# EAGLE design prototype1 (EAGLE 9.3.0)

## Sheet 1 of 5
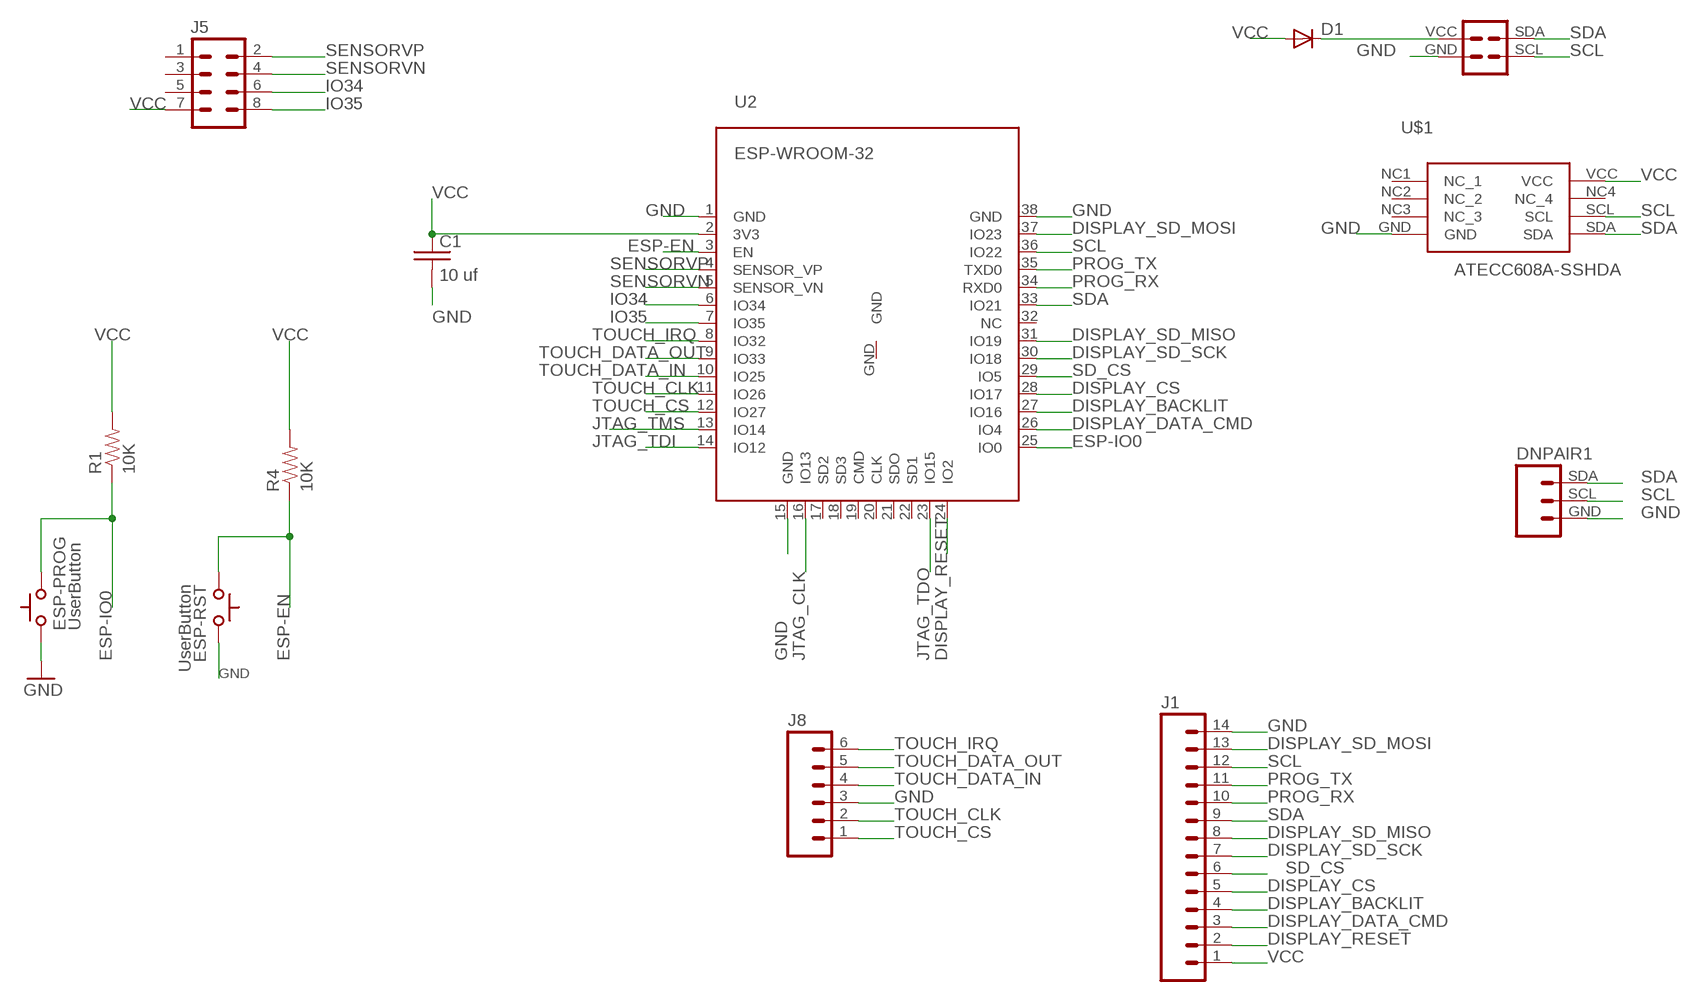
[diagram p0: schematic, sheet 1]

### Parts
C1  10 uf  C-USC0805  [C0805]
D1  DIODESMA  [SMA-DIODE]
DNPAIR1  DARKNET_8_PAIR_CONNECTORPTH  [1X03]
ESP-PROG  UserButton  SWITCH_TACTILETACTILE-2PIN-NARROW  [TACTILE-2PIN-NARROW]
ESP-RST  UserButton  SWITCH_TACTILETACTILE-2PIN-NARROW  [TACTILE-2PIN-NARROW]
J1  M14  [1X14]
J5  M04X2  [2X4]
J8  M06NO_SILK_YES_STOP  [1X06_NO_SILK_YES_STOP]
R1  10K  RESISTOR0805-RES  [0805]
R4  10K  RESISTOR0805-RES  [0805]
SHITTY_ADDON  SAO1  DC26_SHITTY_ADDON_CONNECTORPTH  [DC26SHITTY_ADDON_CONNECTOR]
U2  ESP-WROOM-32  [ESP-WROOM-32]
U$1  ATECC608A-SSHDA  [8-SOIC]

### Nets
DISPLAY_BACKLIT: J1.4 U2.27(IO16)
DISPLAY_CS: J1.5 U2.28(IO17)
DISPLAY_DATA_CMD: J1.3 U2.26(IO4)
DISPLAY_RESET: J1.2 U2.24(IO2)
DISPLAY_SD_MISO: J1.8 U2.31(IO19)
DISPLAY_SD_MOSI: J1.13 U2.37(IO23)
DISPLAY_SD_SCK: J1.7 U2.30(IO18)
ESP-EN: ESP-RST.P$2(C) R4.1 U2.3(EN)
ESP-IO0: ESP-PROG.P$1(A) R1.1 U2.25(IO0)
GND: C1.2 DNPAIR1.GND ESP-PROG.P$2(C) ESP-RST.P$1(A) J1.14 J8.3 SHITTY_ADDON.GND U2.1(GND) U2.15(GND) U2.38(GND) U$1.GND ; also sheet 2,3,4
IO34: J5.6 U2.6(IO34)
IO35: J5.8 U2.7(IO35)
JTAG_CLK: U2.16(IO13) ; also sheet 2
JTAG_TDI: U2.14(IO12) ; also sheet 2
JTAG_TDO: U2.23(IO15) ; also sheet 2
JTAG_TMS: U2.13(IO14) ; also sheet 2
N$14: D1.C SHITTY_ADDON.VCC
PROG_RX: J1.10 U2.34(RXD0)
PROG_TX: J1.11 U2.35(TXD0)
SCL: DNPAIR1.SCL J1.12 SHITTY_ADDON.SCL U2.36(IO22) U$1.SCL
SD_CS: J1.6 U2.29(IO5)
SDA: DNPAIR1.SDA J1.9 SHITTY_ADDON.SDA U2.33(IO21) U$1.SDA
SENSORVN: J5.4 U2.5(SENSOR_VN)
SENSORVP: J5.2 U2.4(SENSOR_VP)
TOUCH_CLK: J8.2 U2.11(IO26)
TOUCH_CS: J8.1 U2.12(IO27)
TOUCH_DATA_IN: J8.4 U2.10(IO25)
TOUCH_DATA_OUT: J8.5 U2.9(IO33)
TOUCH_IRQ: J8.6 U2.8(IO32)
VCC: C1.1 D1.A J1.1 J5.7 R1.2 R4.2 U2.2(3V3) U$1.VCC ; also sheet 2,3,4
Unconnected: J5.1 J5.3 J5.5 U2.17(SD2) U2.18(SD3) U2.19(CMD) U2.20(CLK) U2.21(SDO) U2.22(SD1) U2.32(NC) U2.GND U$1.NC1(NC_1) U$1.NC2(NC_2) U$1.NC3(NC_3) U$1.NC4(NC_4)

## Sheet 2 of 5
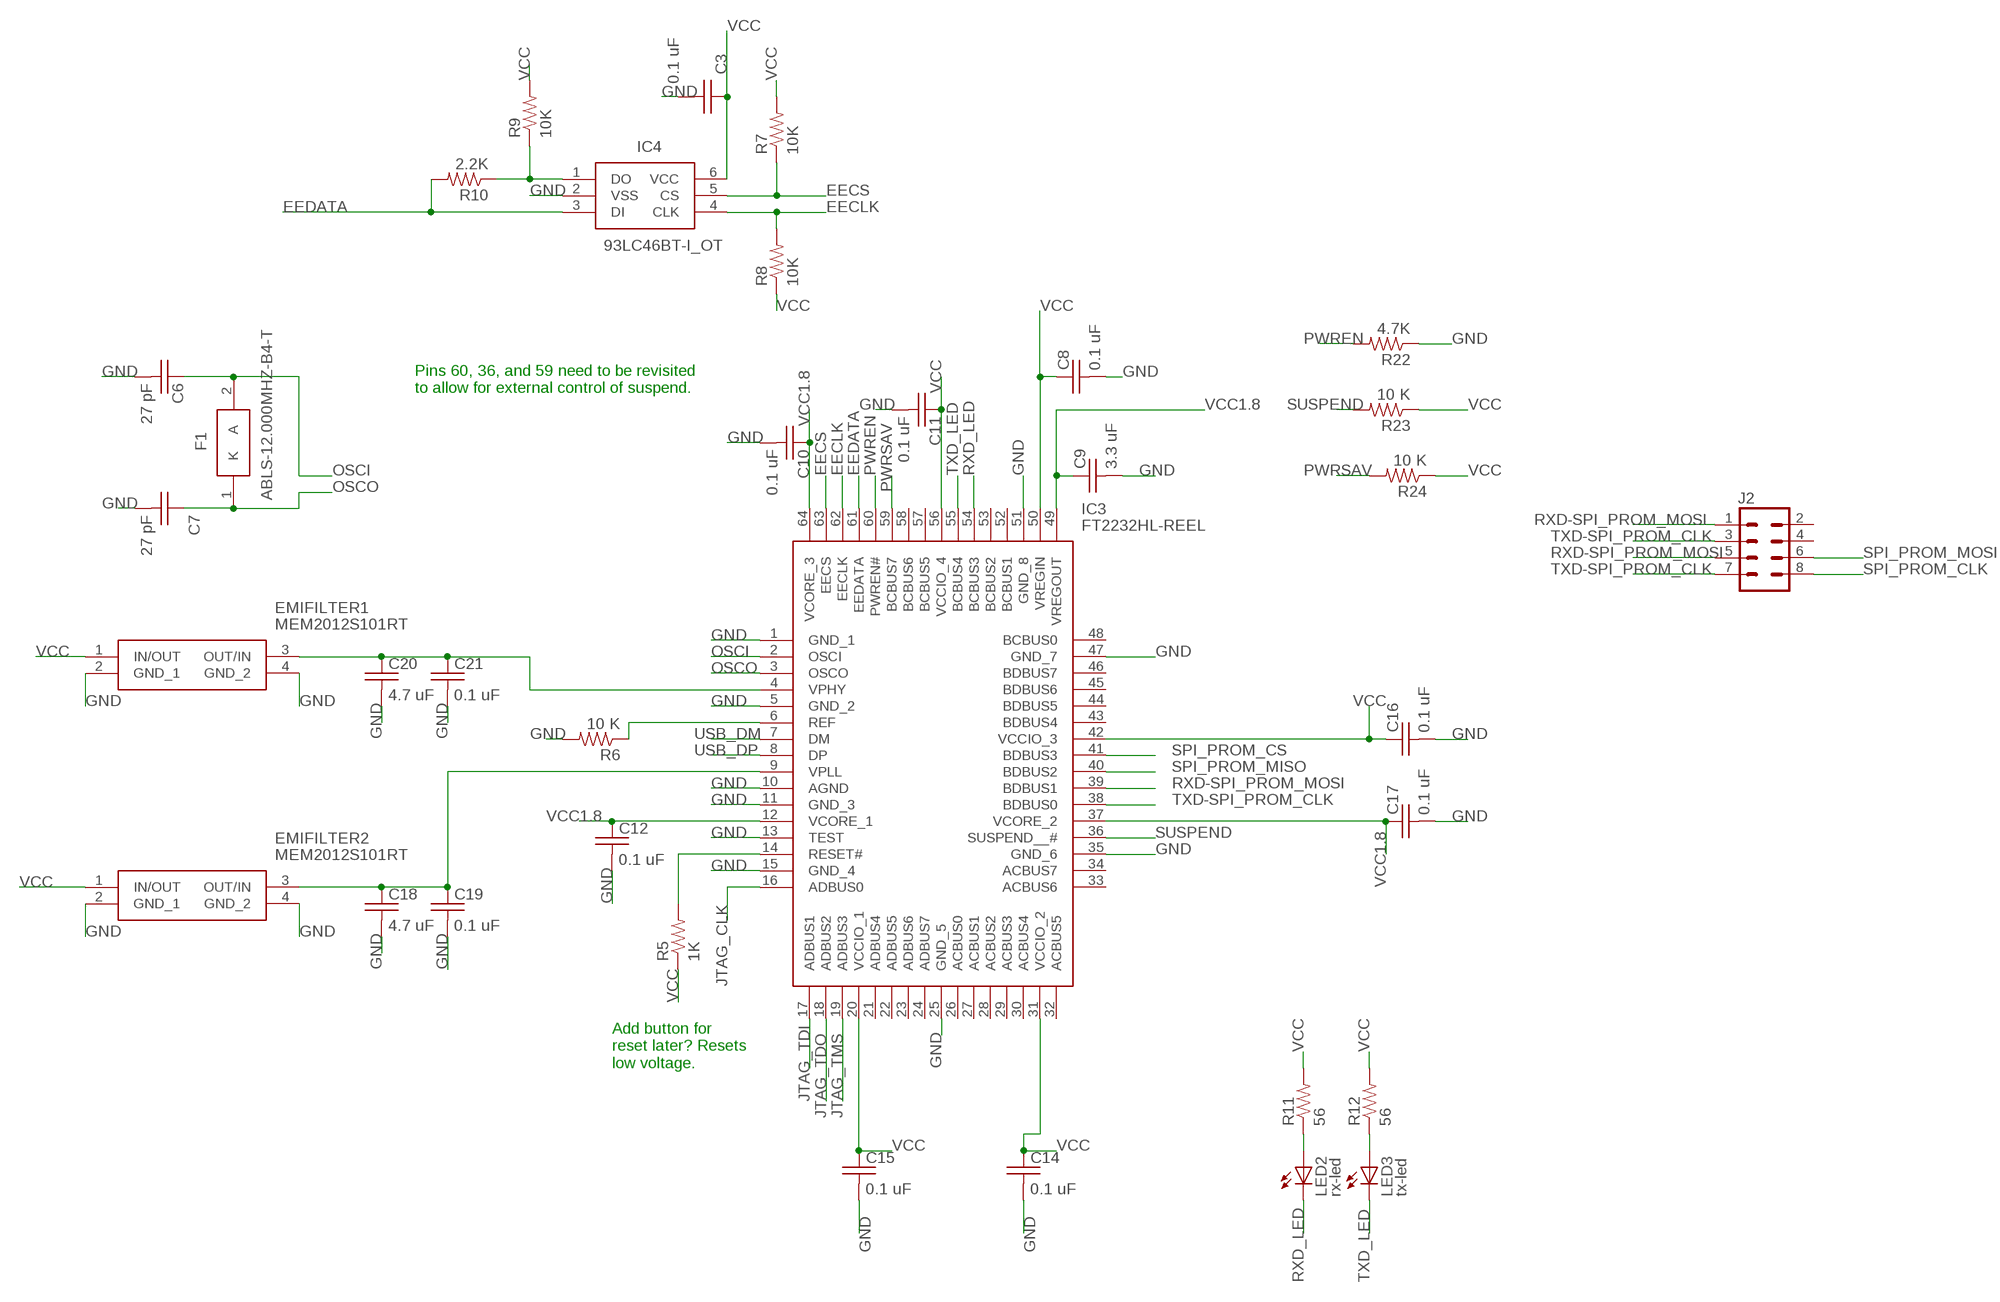
[diagram p1: schematic, sheet 2]

### Parts
C3  0.1 uF  C-USC0805  [C0805]
C6  27 pF  C-USC0805  [C0805]
C7  27 pF  C-USC0805  [C0805]
C8  0.1 uF  C-USC0805  [C0805]
C9  3.3 uF  C-USC0805  [C0805]
C10  0.1 uF  C-USC0805  [C0805]
C11  0.1 uF  C-USC0805  [C0805]
C12  0.1 uF  C-USC0805  [C0805]
C14  0.1 uF  C-USC0805  [C0805]
C15  0.1 uF  C-USC0805  [C0805]
C16  0.1 uF  C-USC0805  [C0805]
C17  0.1 uF  C-USC0805  [C0805]
C18  4.7 uF  C-USC0805  [C0805]
C19  0.1 uF  C-USC0805  [C0805]
C20  4.7 uF  C-USC0805  [C0805]
C21  0.1 uF  C-USC0805  [C0805]
EMIFILTER1  MEM2012S101RT  [MEM2012S101RT]
EMIFILTER2  MEM2012S101RT  [MEM2012S101RT]
F1  ABLS-12.000MHZ-B4-T  [HC/49US-(AT49)_1]
IC3  FT2232HL-REEL  [QFP50P1200X1200X160-64N]
IC4  93LC46BT-I_OT  [SOT95P270X145-6N]
J2  M04X2  [2X4]
LED2  rx-led  LED3MM  [LED3MM]
LED3  tx-led  LED3MM  [LED3MM]
R5  1K  RESISTOR0805-RES  [0805]
R6  10 K  RESISTOR0805-RES  [0805]
R7  10K  RESISTOR0805-RES  [0805]
R8  10K  RESISTOR0805-RES  [0805]
R9  10K  RESISTOR0805-RES  [0805]
R10  2.2K  RESISTOR0805-RES  [0805]
R11  56  RESISTOR0805-RES  [0805]
R12  56  RESISTOR0805-RES  [0805]
R22  4.7K  RESISTOR0805-RES  [0805]
R23  10 K  RESISTOR0805-RES  [0805]
R24  10 K  RESISTOR0805-RES  [0805]

### Nets
EECLK: IC3.62(EECLK) IC4.4(CLK) R8.2
EECS: IC3.63(EECS) IC4.5(CS) R7.1
EEDATA: IC3.61(EEDATA) IC4.3(DI) R10.2
GND: C3.2 C6.2 C7.2 C8.2 C9.2 C10.2 C11.2 C12.2 C14.2 C15.2 C16.2 C17.2 C18.2 C19.2 C20.2 C21.2 EMIFILTER1.2(GND_1) EMIFILTER1.4(GND_2) EMIFILTER2.2(GND_1) EMIFILTER2.4(GND_2) IC3.1(GND_1) IC3.5(GND_2) IC3.10(AGND) IC3.11(GND_3) IC3.13(TEST) IC3.15(GND_4) IC3.25(GND_5) IC3.35(GND_6) IC3.47(GND_7) IC3.51(GND_8) IC4.2(VSS) R6.2 R22.1 ; also sheet 1,3,4
JTAG_CLK: IC3.16(ADBUS0) ; also sheet 1
JTAG_TDI: IC3.17(ADBUS1) ; also sheet 1
JTAG_TDO: IC3.18(ADBUS2) ; also sheet 1
JTAG_TMS: IC3.19(ADBUS3) ; also sheet 1
N$6: IC3.14(RESET#) R5.2
N$7: IC3.6(REF) R6.1
N$8: IC4.1(DO) R9.1 R10.1
N$11: LED2.A R11.1
N$13: LED3.A R12.1
N$18: C18.1 C19.1 EMIFILTER2.3(OUT/IN) IC3.9(VPLL)
N$19: C20.1 C21.1 EMIFILTER1.3(OUT/IN) IC3.4(VPHY)
OSCI: C6.1 F1.2(A) IC3.2(OSCI)
OSCO: C7.1 F1.1(K) IC3.3(OSCO)
PWREN: IC3.60(PWREN#) R22.2
PWRSAV: IC3.59(BCBUS7) R24.2
RXD-SPI_PROM_MOSI: IC3.39(BDBUS1) J2.1 J2.5
RXD_LED: IC3.54(BCBUS3) LED2.K(C)
SPI_PROM_CLK: J2.8 ; also sheet 3
SPI_PROM_CS: IC3.41(BDBUS3) ; also sheet 3
SPI_PROM_MISO: IC3.40(BDBUS2) ; also sheet 3
SPI_PROM_MOSI: J2.6 ; also sheet 3
SUSPEND: IC3.36(SUSPEND__#) R23.2
TXD-SPI_PROM_CLK: IC3.38(BDBUS0) J2.3 J2.7
TXD_LED: IC3.55(BCBUS4) LED3.K(C)
USB_DM: IC3.7(DM) ; also sheet 4
USB_DP: IC3.8(DP) ; also sheet 4
VCC: C3.1 C8.1 C11.1 C14.1 C15.1 C16.1 EMIFILTER1.1(IN/OUT) EMIFILTER2.1(IN/OUT) IC3.20(VCCIO_1) IC3.31(VCCIO_2) IC3.42(VCCIO_3) IC3.50(VREGIN) IC3.56(VCCIO_4) IC4.6(VCC) R5.1 R7.2 R8.1 R9.2 R11.2 R12.2 R23.1 R24.1 ; also sheet 1,3,4
VCC1.8: C9.1 C10.1 C12.1 C17.1 IC3.12(VCORE_1) IC3.37(VCORE_2) IC3.49(VREGOUT) IC3.64(VCORE_3)
Unconnected: IC3.21(ADBUS4) IC3.22(ADBUS5) IC3.23(ADBUS6) IC3.24(ADBUS7) IC3.26(ACBUS0) IC3.27(ACBUS1) IC3.28(ACBUS2) IC3.29(ACBUS3) IC3.30(ACBUS4) IC3.32(ACBUS5) IC3.33(ACBUS6) IC3.34(ACBUS7) IC3.43(BDBUS4) IC3.44(BDBUS5) IC3.45(BDBUS6) IC3.46(BDBUS7) IC3.48(BCBUS0) IC3.52(BCBUS1) IC3.53(BCBUS2) IC3.57(BCBUS5) IC3.58(BCBUS6) J2.2 J2.4

### Notes on the sheet
- Pins 60, 36, and 59 need to be revisited 
  to allow for external control of suspend.
- Add button for 
  reset later? Resets
  low voltage.

## Sheet 3 of 5
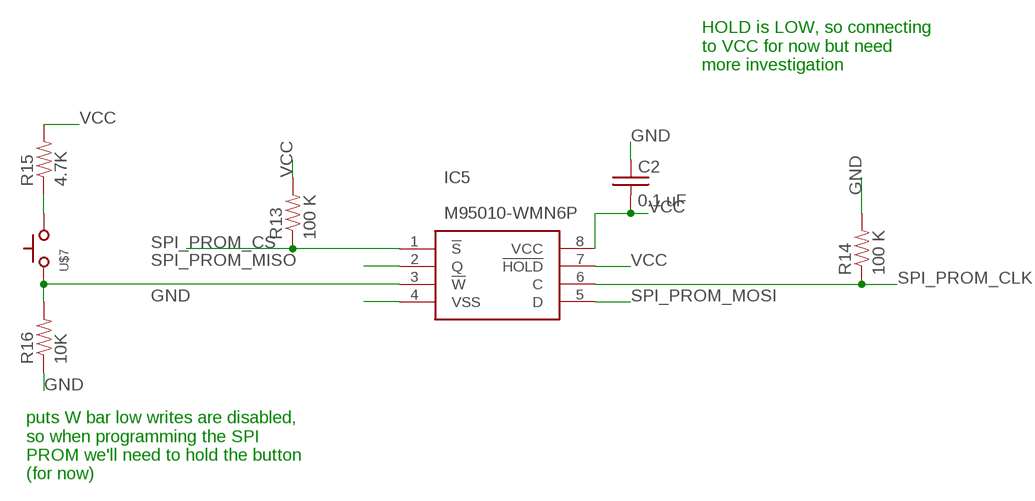
[diagram p2: schematic, sheet 3]

### Parts
C2  0.1 uF  C-USC0805  [C0805]
IC5  M95010-WMN6P  [SOIC127P600X175-8N]
R13  100 K  RESISTOR0805-RES  [0805]
R14  100 K  RESISTOR0805-RES  [0805]
R15  4.7K  RESISTOR0805-RES  [0805]
R16  10K  RESISTOR0805-RES  [0805]
U$7  SWITCH_TACTILETACTILE-2PIN-NARROW  [TACTILE-2PIN-NARROW]

### Nets
GND: C2.1 IC5.4(VSS) R14.2 R16.1 ; also sheet 1,2,4
N$3: IC5.3(!W) R16.2 U$7.P$2(C)
N$9: R15.1 U$7.P$1(A)
SPI_PROM_CLK: IC5.6(C) R14.1 ; also sheet 2
SPI_PROM_CS: IC5.1(!S) R13.1 ; also sheet 2
SPI_PROM_MISO: IC5.2(Q) ; also sheet 2
SPI_PROM_MOSI: IC5.5(D) ; also sheet 2
VCC: C2.2 IC5.7(!HOLD) IC5.8(VCC) R13.2 R15.2 ; also sheet 1,2,4

### Notes on the sheet
- HOLD is LOW, so connecting 
  to VCC for now but need 
  more investigation
- puts W bar low writes are disabled, 
  so when programming the SPI 
  PROM we'll need to hold the button 
  (for now)

## Sheet 4 of 5
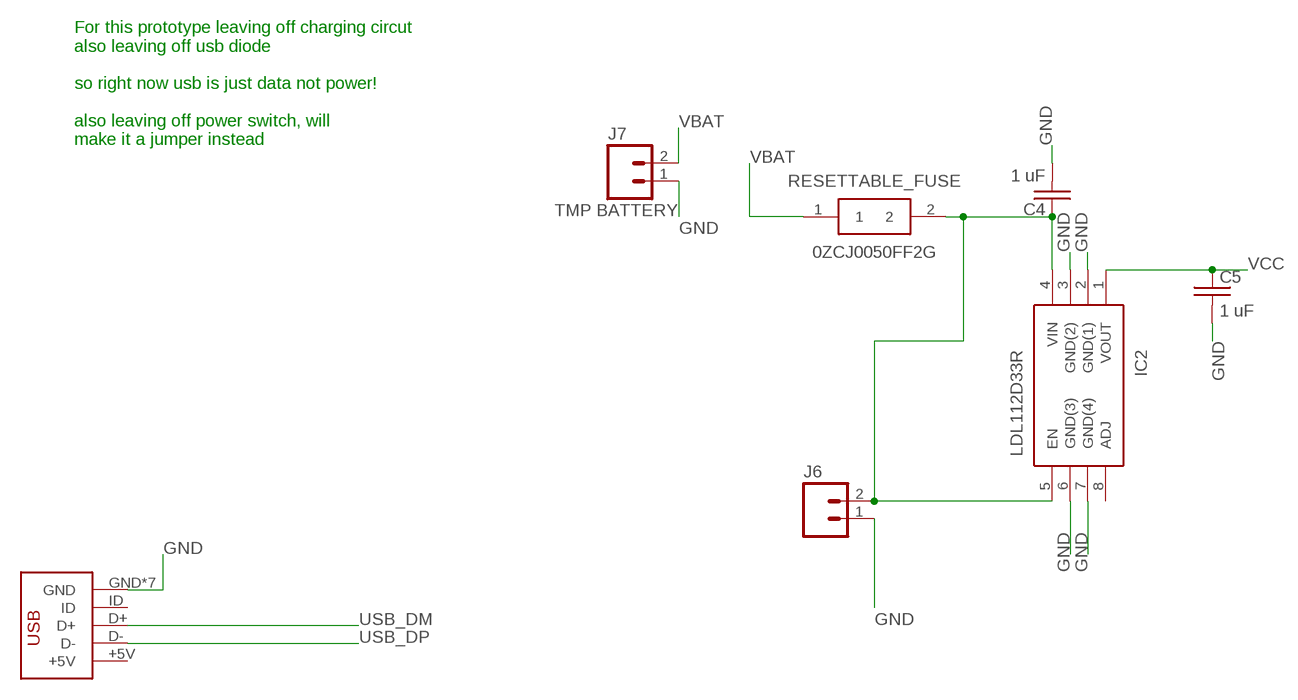
[diagram p3: schematic, sheet 4]

### Parts
C4  1 uF  C-USC0805  [C0805]
C5  1 uF  C-USC0805  [C0805]
IC2  LDL112D33R  [SOIC127P600X175-8N]
J6  M02PTH  [1X02]
J7  TMP BATTERY  M02PTH  [1X02]
RESETTABLE_FUSE  0ZCJ0050FF2G  [FUSC3216X55N]
U$2  DX4R005JJ2DX4R005JJ2  [DX4R005JJ2]

### Nets
GND: C4.2 C5.2 IC2.2(GND(1)) IC2.3(GND(2)) IC2.6(GND(3)) IC2.7(GND(4)) J6.1 J7.1 U$2.GND U$2.P$6(GND) U$2.P$7(GND) U$2.P$8(GND) U$2.P$9(GND) U$2.P$10(GND) U$2.P$11(GND) ; also sheet 1,2,3
N$12: C4.1 IC2.4(VIN) IC2.5(EN) J6.2 RESETTABLE_FUSE.2
USB_DM: U$2.D+ ; also sheet 2
USB_DP: U$2.D- ; also sheet 2
VBAT: J7.2 RESETTABLE_FUSE.1
VCC: C5.1 IC2.1(VOUT) ; also sheet 1,2,3
Unconnected: IC2.8(ADJ) U$2.+5V U$2.ID

### Notes on the sheet
- For this prototype leaving off charging circut
  also leaving off usb diode
  
  so right now usb is just data not power!
  
  also leaving off power switch, will 
  make it a jumper instead

## Sheet 5 of 5
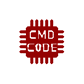
[diagram p4: schematic, sheet 5]

### Parts
U$3  CMD_C0DE_LOGOCMD_CODE_LOGO_TOP_COPPER  [CMD_C0DE_LOGO_TOP_COPPER]

## Library data of the parts
C1-C12 C14-C21 = passives:C-US: CAPACITOR, American symbol
D1 = passives:DIODE: Diode These are standard reverse protection diodes and small signal diodes. SMA package can handle up to about 1A. SOD-323 can handle about 200mA. What the SOD-323 package when ordering, there are some mfgs out there that are 5-pin packages.
DNPAIR1 = darknet8:DARKNET_8_PAIR_CONNECTOR: Header 3 Standard 3-pin 0.1" header. Use with straight break away headers (SKU : PRT-00116), right angle break away headers (PRT-00553), swiss pins (PRT-00743), machine pins (PRT-00117), and female headers (PRT-00115).
EMIFILTER1 EMIFILTER2 = passives:MEM2012S101RT: EMI Filter Circuits Source: Datasheet <https://componentsearchengine.com/Datasheets/1/MEM2012S101RT.pdf>; DESCRIPTION: EMI Filter Circuits; HEIGHT: 1mm; MANUFACTURER_NAME: TDK; MANUFACTURER_PART_NUMBER: MEM2012S101RT; MOUSER_PART_NUMBER: N/A
ESP-PROG ESP-RST = dc-26:SWITCH_TACTILE
F1 = crystals-timing:ABLS-12.000MHZ-B4-T: ABRACON - ABLS-12.000MHZ-B4-T - CRYSTAL, 12MHZ, 18PF, HC-49US Source: Datasheet <https://componentsearchengine.com/Datasheets/2/ABLS-12.000MHZ-B4-T.pdf>; DESCRIPTION: ABRACON - ABLS-12.000MHZ-B4-T - CRYSTAL, 12MHZ, 18PF, HC-49US; HEIGHT: mm; MANUFACTURER_NAME: ABRACON; MANUFACTURER_PART_NUMBER: ABLS-12.000MHZ-B4-T; MOUSER_PART_NUMBER: 815-ABLS-12.0M-T; MOUSER_PRICE-STOCK: https://www.mouser.com/Search/Refine.aspx?Keyword=815-ABLS-12.0M-T; RS_PART_NUMBER: 1710207; RS_PRICE-STOCK: http://uk.rs-online.com/web/p/products/1710207
IC2 = voltage-regulator:LDL112D33R: LDO Voltage Regulators 1.2 A low quiescent current LDO with reverse current protection Source: Datasheet <https://www.arrow.com/en/products/ldl112d33r/stmicroelectronics>; ARROW_PART_NUMBER: LDL112D33R; ARROW_PRICE/STOCK: https://www.arrow.com/en/products/ldl112d33r/stmicroelectronics; DESCRIPTION: LDO Voltage Regulators 1.2 A low quiescent current LDO with reverse current protection; HEIGHT: 1.75mm; MANUFACTURER_NAME: STMicroelectronics; MANUFACTURER_PART_NUMBER: LDL112D33R
IC3 = ICs:FT2232HL-REEL: FTDI Chip FT2232HL-REEL, USB Controller, 4-channel, 480MBps, USB 2.0, 64-Pin LQFP Source: Datasheet <https://componentsearchengine.com/Datasheets/1/FT2232HL-REEL.pdf>; DESCRIPTION: FTDI Chip FT2232HL-REEL, USB Controller, 4-channel, 480MBps, USB 2.0, 64-Pin LQFP; HEIGHT: 1.6mm; MANUFACTURER_NAME: FTDI Chip; MANUFACTURER_PART_NUMBER: FT2232HL-REEL; MOUSER_PART_NUMBER: 895-FT2232HL
IC4 = eeprom:93LC46BT-I_OT: 1K,64 X 16 Serial EE,SOT23 Source: Datasheet <https://componentsearchengine.com/Datasheets/1/93LC46BT-I_OT.pdf>; DESCRIPTION: 1K,64 X 16 Serial EE,SOT23; HEIGHT: 1.45mm; MANUFACTURER_NAME: Microchip; MANUFACTURER_PART_NUMBER: 93LC46BT-I/OT; MOUSER_PART_NUMBER: 579-93LC46BT-I/OT
IC5 = eeprom:M95010-WMN6P: M95010-WMN6P, Serial EEPROM Memory 1kbit, Serial-SPI, 35ns 2.5 5.5 V, 8-Pin SOIC Source: Datasheet <http://www.st.com/st-web-ui/static/active/en/resource/technical/document/datasheet/CD00001755.pdf>; ALLIED_NUMBER: 70389563; ALLIED_PRICE-STOCK: http://www.alliedelec.com/stmicroelectronics-m95010-wmn6p/70389563/; DESCRIPTION: M95010-WMN6P, Serial EEPROM Memory 1kbit, Serial-SPI, 35ns 2.5 5.5 V, 8-Pin SOIC; HEIGHT: 1.75mm; MANUFACTURER_NAME: STMicroelectronics; MANUFACTURER_PART_NUMBER: M95010-WMN6P; MOUSER_PART_NUMBER: 511-M95010-WMN6P; MOUSER_PRICE-STOCK: https://www.mouser.com/Search/Refine.aspx?Keyword=511-M95010-WMN6P; RS_PART_NUMBER: 7147617; RS_PRICE-STOCK: http://uk.rs-online.com/web/p/eeprom-memory-chips/7147617/?source=DS
J1 = connector:M14: Header 14 Standard 14-pin 0.1" header. Use with straight break away headers (SKU : PRT-00116), right angle break away headers (PRT-00553), swiss pins (PRT-00743), machine pins (PRT-00117), and female headers (PRT-00115).
J2 J5 = connector:M04X2: .1" header, two rows of four.
J6 J7 = connector:M02: Standard 2-pin 0.1" header. Use with - straight break away headers ( PRT-00116) - right angle break away headers (PRT-00553) - swiss pins (PRT-00743) - machine pins (PRT-00117) - female headers (PRT-00115) Molex polarized connector foot print use with: PRT-08233 with associated crimp pins and housings. 2.54_SCREWTERM for use with PRT-10571. 3.5mm Screw Terminal footprints for PRT-08084 5mm Screw Terminal footprints for use with PRT-08432
J8 = connector:M06: Header 6 Standard 6-pin 0.1" header. Use with straight break away headers (SKU : PRT-00116), right angle break away headers (PRT-00553), swiss pins (PRT-00743), machine pins (PRT-00117), and female headers (PRT-00115). Molex polarized connector foot print use with SKU : PRT-08094 with associated crimp pins and housings. NOTES ON THE VARIANTS LOCK and LOCK_LONGPADS... This footprint was designed to help hold the alignment of a through-hole component (i.e. 6-pin header) while soldering it into place. You may notice that each hole has been shifted either up or down by 0.005 of an inch from it's more standard position (which is a perfectly straight line). This slight alteration caused the pins (the squares in the middle) to touch the edges of the holes. Because they are alternating, it causes a "brace" to hold the component in place. 0.005 has proven to be the perfect amount of "off-center" position when using our standard breakaway headers. Although looks a little odd when you look at the bare footprint, once you have a header in there, the alteration is very hard to notice. Also,if you push a header all the way into place, it is covered up entirely on the bottom side. This idea of altering the position of holes to aid alignment will be further integrated into the Sparkfun Library for other footprints. It can help hold any component with 3 or more connection pins.
LED2 LED3 = leds:LED: LEDs Standard schematic elements and footprints for 5mm, 3mm, 1206, and 0603 sized LEDs. 5mm - Spark Fun Electronics SKU : COM-00529 (and others)
R1 R4 = dc-26:RESISTOR: Resistor Basic schematic elements and footprints for 0603, 1206, and PTH resistors.
R5-R16 R22-R24 = passives:RESISTOR: Resistor Basic schematic elements and footprints for 0603, 1206, and PTH resistors.
RESETTABLE_FUSE = passives:0ZCJ0050FF2G: Resettable Fuses - PPTC <https://componentsearchengine.com/Images/9/0ZCJ0050FF2G.jpg> Source: Datasheet <https://www.belfuse.com/resources/CircuitProtection/datasheets/0ZCJ Nov2016.pdf>; DESCRIPTION: Resettable Fuses - PPTC; HEIGHT: 0.55mm; MANUFACTURER_NAME: Bel-Stewart; MANUFACTURER_PART_NUMBER: 0ZCJ0050FF2G; SUPPLIER_NAME: RS
SHITTY_ADDON = defcon:DC26_SHITTY_ADDON_CONNECTOR: Standard 2-pin 0.1" header. Use with - straight break away headers ( PRT-00116) - right angle break away headers (PRT-00553) - swiss pins (PRT-00743) - machine pins (PRT-00117) - female headers (PRT-00115) Molex polarized connector foot print use with: PRT-08233 with associated crimp pins and housings. 2.54_SCREWTERM for use with PRT-10571. 3.5mm Screw Terminal footprints for PRT-08084 5mm Screw Terminal footprints for use with PRT-08432
U2 = ICs:ESP-WROOM-32
U$1 = ICs:ATECC608A-SSHDA
U$2 = connector:DX4R005JJ2
U$3 = logos:CMD_C0DE_LOGO
U$7 = switches:SWITCH_TACTILE

## Board
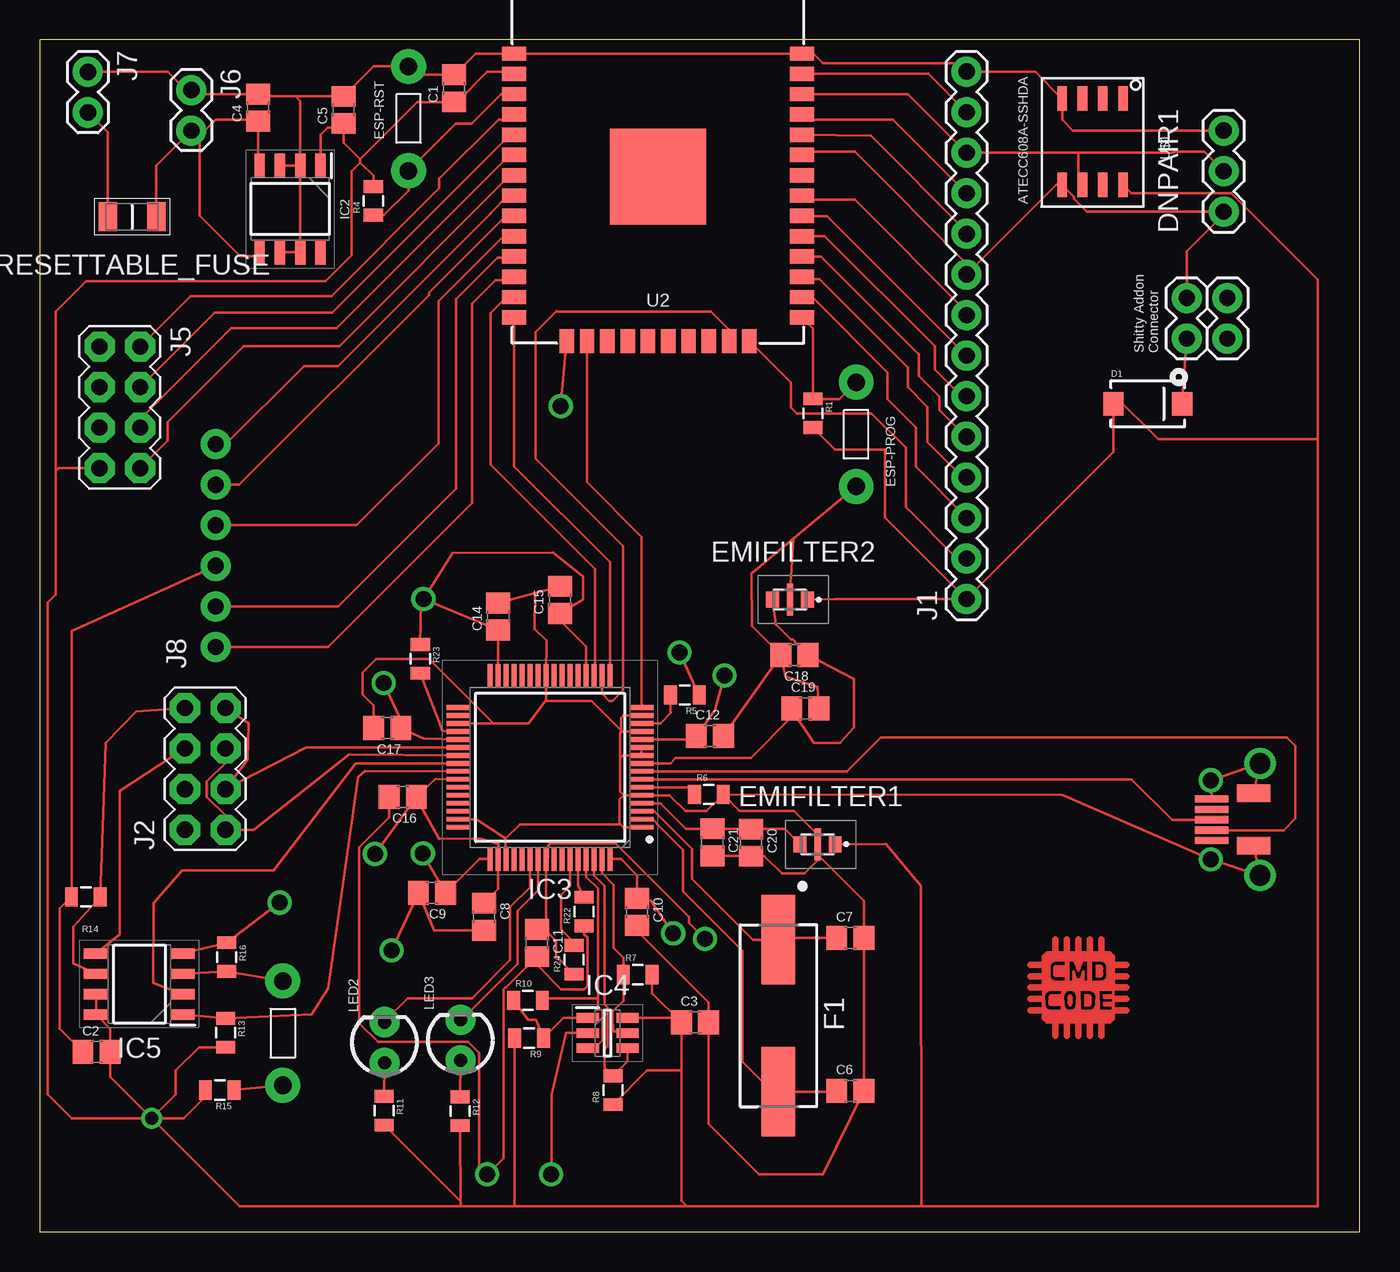
[diagram p5: board, top side]
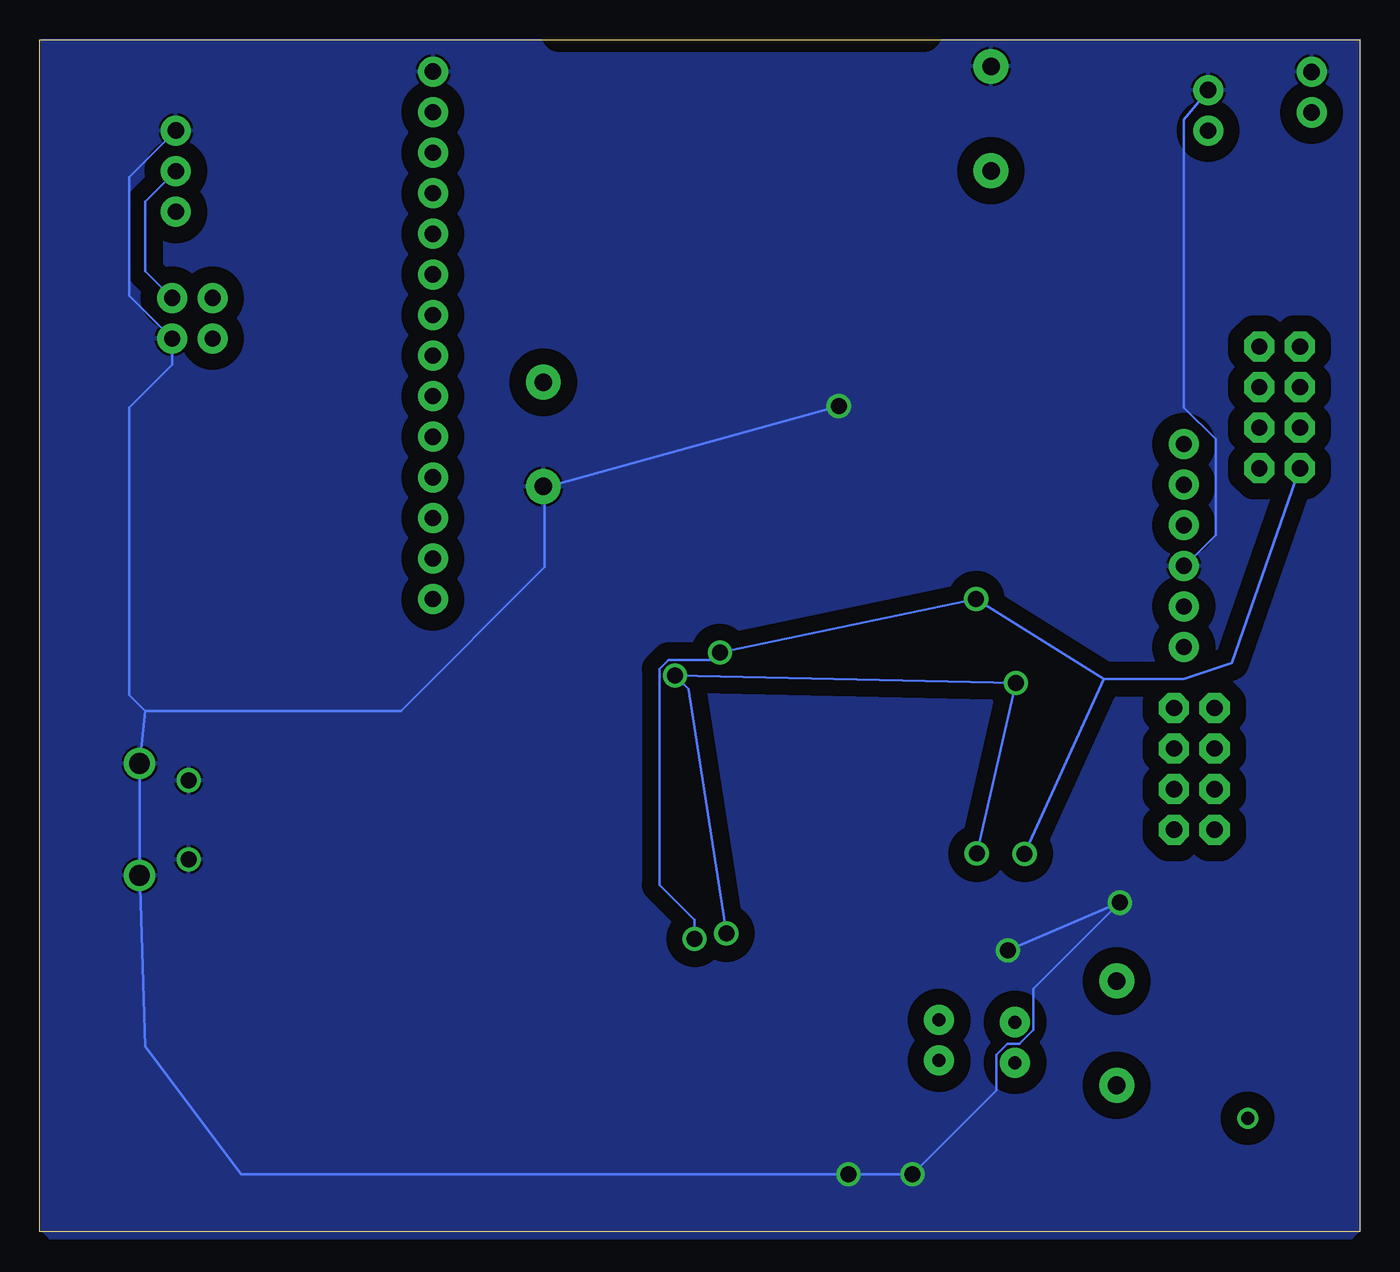
[diagram p6: board, bottom side, seen from below]

Size 82.6 x 74.6 mm. Coordinates in mm from the lower left corner, seen from the top.
Outline: 0,0 82.6,0 82.6,74.6 0,74.6 0,0
Copper layers (1*16): Top 0.035mm / dielectric 1.5mm / Bottom 0.035mm
Design rules "OthermillDRC_30_deg_v2 *": minimum track width 6mil, minimum drill 0.8mm, track to track 9mil, track to pad 6mil, pad to pad 6mil, via to via 6mil, smd to smd 0mil, copper to edge 0mil, drill to drill 6mil, minimum pad ring 10mil, minimum via ring 10mil, stop-mask expansion 1mil, vias tented up to drill 30mil, thermal gap 6mil

### Footprints (pad centres in the part's own frame; a part is rotated, then mirrored left to right if it is on the bottom)
C0805 = smd 1.3 x 1.5: 1 -0.85,0; 2 0.85,0
SMA-DIODE = smd 1.27 x 1.47: A -2.15,0; C 2.15,0
1X03 = drill 1.016 pad 1.88: GND 5.08,0; SCL 2.54,0; SDA 0,0
MEM2012S101RT = smd 0.8 x 1: 1 -1.1,0; 3 1.1,0 | smd 0.4 x 1: 2 0,-0.5; 4 0,0.5
TACTILE-2PIN-NARROW = drill 1.1 pad 2.184: P$1 3.264,0; P$2 -3.264,0
HC/49US-(AT49)_1 = smd 5.6 x 2.1: 1 -4.75,0; 2 4.75,0
SOIC127P600X175-8N = smd 1.525 x 0.65: 1 -2.712,1.905; 2 -2.712,0.635; 3 -2.712,-0.635; 4 -2.712,-1.905; 5 2.712,-1.905; 6 2.712,-0.635; 7 2.712,0.635; 8 2.712,1.905
QFP50P1200X1200X160-64N = smd 1.475 x 0.3: 1 -5.738,3.75; 2 -5.738,3.25; 3 -5.738,2.75; 4 -5.738,2.25; 5 -5.738,1.75; 6 -5.738,1.25; 7 -5.738,0.75; 8 -5.738,0.25; 9 -5.738,-0.25; 10 -5.738,-0.75; 11 -5.738,-1.25; 12 -5.738,-1.75; 13 -5.738,-2.25; 14 -5.738,-2.75; 15 -5.738,-3.25; 16 -5.738,-3.75; 33 5.738,-3.75; 34 5.738,-3.25; 35 5.738,-2.75; 36 5.738,-2.25; 37 5.738,-1.75; 38 5.738,-1.25; 39 5.738,-0.75; 40 5.738,-0.25; 41 5.738,0.25; 42 5.738,0.75; 43 5.738,1.25; 44 5.738,1.75; 45 5.738,2.25; 46 5.738,2.75; 47 5.738,3.25; 48 5.738,3.75 | smd 0.3 x 1.475: 17 -3.75,-5.738; 18 -3.25,-5.738; 19 -2.75,-5.738; 20 -2.25,-5.738; 21 -1.75,-5.738; 22 -1.25,-5.738; 23 -0.75,-5.738; 24 -0.25,-5.738; 25 0.25,-5.738; 26 0.75,-5.738; 27 1.25,-5.738; 28 1.75,-5.738; 29 2.25,-5.738; 30 2.75,-5.738; 31 3.25,-5.738; 32 3.75,-5.738; 49 3.75,5.738; 50 3.25,5.738; 51 2.75,5.738; 52 2.25,5.738; 53 1.75,5.738; 54 1.25,5.738; 55 0.75,5.738; 56 0.25,5.738; 57 -0.25,5.738; 58 -0.75,5.738; 59 -1.25,5.738; 60 -1.75,5.738; 61 -2.25,5.738; 62 -2.75,5.738; 63 -3.25,5.738; 64 -3.75,5.738
SOT95P270X145-6N = smd 1.4 x 0.6: 1 -1.25,0.95; 2 -1.25,0; 3 -1.25,-0.95; 4 1.25,-0.95; 5 1.25,0; 6 1.25,0.95
1X14 = drill 1.016 pad 1.88: 1 0,0; 2 2.54,0; 3 5.08,0; 4 7.62,0; 5 10.16,0; 6 12.7,0; 7 15.24,0; 8 17.78,0; 9 20.32,0; 10 22.86,0; 11 25.4,0; 12 27.94,0; 13 30.48,0; 14 33.02,0
2X4 = drill 1.016 pad 1.88 octagon: 1 -3.81,-1.27; 2 -3.81,1.27; 3 -1.27,-1.27; 4 -1.27,1.27; 5 1.27,-1.27; 6 1.27,1.27; 7 3.81,-1.27; 8 3.81,1.27
1X02 = drill 1.016 pad 1.88: 1 0,0; 2 2.54,0
1X06_NO_SILK_YES_STOP = drill 1.016 pad 1.88: 1 0,0; 2 2.54,0; 3 5.08,0; 4 7.62,0; 5 10.16,0; 6 12.7,0
LED3MM = drill 0.813 pad 1.88: A -1.27,0; K 1.27,0
0805 = smd 0.8 x 1.2: 1 -0.9,0; 2 0.9,0
FUSC3216X55N = smd 1.17 x 1.82: 1 -1.52,0; 2 1.52,0
DC26SHITTY_ADDON_CONNECTOR = drill 1.016 pad 1.88: GND 0,-2.54; SCL 2.54,-2.54; SDA 2.54,0; VCC 0,0
ESP-WROOM-32 = smd 0.9 x 1.5: 1 7.7,9; 2 6.43,9; 3 5.16,9; 4 3.89,9; 5 2.62,9; 6 1.35,9; 7 0.08,9; 8 -1.19,9; 9 -2.46,9; 10 -3.73,9; 11 -5,9; 12 -6.27,9; 13 -7.54,9; 14 -8.81,9; 25 -8.81,-9; 26 -7.54,-9; 27 -6.27,-9; 28 -5,-9; 29 -3.73,-9; 30 -2.46,-9; 31 -1.19,-9; 32 0.08,-9; 33 1.35,-9; 34 2.62,-9; 35 3.89,-9; 36 5.16,-9; 37 6.43,-9; 38 7.7,-9 | smd 1.5 x 0.9: 15 -10.3,5.715; 16 -10.3,4.445; 17 -10.3,3.175; 18 -10.3,1.905; 19 -10.3,0.635; 20 -10.3,-0.635; 21 -10.3,-1.905; 22 -10.3,-3.175; 23 -10.3,-4.445; 24 -10.3,-5.715 | smd 6 x 6: GND 0,0
8-SOIC = smd 0.6 x 1.55: GND 3.81,0; NC1 0,0; NC2 1.27,0; NC3 2.54,0; NC4 1.27,5.4; SCL 2.54,5.4; SDA 3.81,5.4; VCC 0,5.4
DX4R005JJ2 = smd 2.1 x 0.45: +5V 0.72,-1.32; D+ 0.72,-0.02; D- 0.72,-0.67; GND 0.72,1.28; ID 0.72,0.63 | smd 2.1 x 1.1: P$6 3.35,1.65; P$8 3.35,-1.65 | drill 1: P$7 0.675,2.45; P$9 0.675,-2.5 | drill 1.3: P$10 3.75,-3.5; P$11 3.75,3.5

### Placement (x,y rotation side)
C1  25.93,71.57 90 top
C2  3.55,11.25 0 top
C3  41,13.1 0 top
C4  13.66,70.36 90 top
C5  19.01,70.22 90 top
C6  50.73,8.82 0 top
C7  50.73,18.39 0 top
C8  27.79,19.72 270 top
C9  24.54,21.22 180 top
C10  37.37,20.02 270 top
C11  31.1,18.07 270 top
C12  41.93,31.04 0 top
C14  28.69,38.51 90 top
C15  32.54,39.55 90 top
C16  22.71,27.21 180 top
C17  21.74,31.53 180 top
C18  47.23,36.1 180 top
C19  47.9,32.76 0 top
C20  44.51,24.35 270 top
C21  42.08,24.37 270 top
D1  69.34,51.83 0 top
DNPAIR1  74.09,63.85 90 top
EMIFILTER1  48.67,24.25 180 top
EMIFILTER2  46.95,39.56 180 top
ESP-PROG  51.09,49.91 90 top
ESP-RST  23.07,69.68 90 top
F1  46.22,13.52 270 top
IC2  15.66,64.02 270 top
IC3  31.93,29.07 180 top
IC4  35.53,12.43 0 top
IC5  6.22,15.5 180 top
J1  58,39.6 90 top
J2  10.35,28.97 90 top
J5  5,51.6 270 top
J6  9.48,71.46 270 top
J7  3,72.6 270 top
J8  11,36.6 90 top
LED2  21.57,11.85 90 top
LED3  26.32,11.99 90 top
R1  48.39,51.23 270 top
R4  20.87,64.52 90 top
R5  40.37,33.61 180 top
R6  41.87,27.36 0 top
R7  37.42,16.09 0 top
R8  35.87,8.85 90 top
R9  30.62,12.12 180 top
R10  30.54,14.48 0 top
R11  21.54,7.58 270 top
R12  26.3,7.54 270 top
R13  11.62,12.45 270 top
R14  2.88,20.95 180 top
R15  11.26,8.87 180 top
R16  11.7,17.19 270 top
R22  34.05,20.04 90 top
R23  23.81,35.86 270 top
R24  33.43,17.02 90 top
RESETTABLE_FUSE  5.77,63.53 0 top
SHITTY_ADDON  71.79,55.91 90 top
U2  38.69,66.04 90 top
U$1  67.79,70.93 180 top
U$2  72.62,25.81 0 top
U$3  65,15.6 0 top
U$7  15.2,12.43 270 top

### Tracks (layer width: path | path; a pad name or v marks a point on that pad's centre or on a via)
DISPLAY_BACKLIT
  Top 0.152: U2.27 47.82,59.64 48.79,59.64 54.33,54.1 54.33,52.86 55.56,51.63 55.56,49.42 57.76,47.22 J1.4
DISPLAY_CS
  Top 0.152: U2.28 48.88,61.04 55.03,54.89 55.03,53.54 56.29,52.29 56.29,51.43 57.96,49.76 J1.5
DISPLAY_DATA_CMD
  Top 0.152: U2.26 48.34,58.5 53.06,53.79 53.06,52.12 54.83,50.35 54.83,47.89 58,44.72 J1.3
DISPLAY_RESET
  Top 0.152: U2.24 47,53.15 47,51.6 47.38,51.22 52.05,51.22 54.19,49.07 54.19,45.35 57.4,42.14 J1.2
DISPLAY_SD_MISO
  Top 0.152: U2.31 47.94,64.6 51,64.6 58,57.6 J1.8
DISPLAY_SD_MOSI
  Top 0.152: U2.37 55.61,72.47 J1.13
DISPLAY_SD_SCK
  Top 0.152: U2.30 49.26,63.58 J1.7
EECLK
  Top 0.152: IC3.62 34.68,22.29 35.33,21.64 35.33,14.24 35.51,14.05 35.51,11.59 35.33,11.41 35.33,10.29 R8.2 36.78,10.67 IC4.4
EECS
  Top 0.152: IC3.63 35.18,22.45 35.92,21.72 35.92,17.76 36.52,17.15 R7.1 36.52,14.45 35.85,13.78 35.85,12.99 35.88,12.96 35.88,12.55 36.67,12.55 IC4.5
EEDATA
  Top 0.152: IC3.61 34.18,22.22 34.93,21.48 34.93,14.61 | 34.93,14.61 34.93,14.06 35.21,13.78 35.21,11.97 34.73,11.48 IC4.3 | 34.93,14.61 31.57,14.61 R10.2
ESP-EN
  Top 0.152: U2.3 28.87,71.2 27.01,69.34 26,69.34 ESP-RST.P$2 23.07,65.17 21.52,63.62 R4.1
ESP-IO0
  Top 0.152: U2.25 48.39,56.53 R1.1 50.05,52.13 ESP-PROG.P$1
GND  (via drill 1)
  Top 0.152: 16,71.07 C5.2 20.89,72.94 ESP-RST.P$1 23.6,72.42 C1.2 27.26,73.74 U2.1 U2.38 48.42,73.74 49.01,73.15 57.47,73.15 J1.14 58.02,72.6 62.31,72.6 U$1.GND 64,70.91 64,69.6 64.67,68.93 DNPAIR1.GND | 16,71.07 13.8,71.07 C4.2 9.73,71.21 J6.1 9.14,71.46 8,72.6 J7.1 | R6.2 41.74,26.33 40.41,26.33 39.42,27.32 IC3.5 36.56,27.32 | R6.2 43.8,26.34 47.21,26.34 48.67,24.87 EMIFILTER1.2 EMIFILTER1.4 48.67,23.62 | C21.2 44.49,23.52 C20.2 45.34,23.5 46.43,22.42 47.85,22.42 48.67,23.24 48.67,23.62 | 48.67,23.62 51.58,20.72 C7.2 C6.2 49,3.6 45,3.6 41.85,6.75 C3.2 41.85,14.37 37.38,18.84 C10.2 | IC3.1 36.52,25.32 36.32,25.51 | 36.32,25.51 36.27,25.57 36.27,27.06 36.53,27.32 36.56,27.32 | IC3.11 IC3.10 36.5,29.82 36.31,29.63 36.31,29.57 | 36.31,29.57 36.31,27.57 36.56,27.32 | IC3.13 36.44,31.32 | 36.44,31.32 36.36,31.24 | 36.31,29.57 36.32,29.58 36.32,31.2 36.36,31.24 | IC3.15 36.52,32.32 36.36,32.16 36.36,31.24 | 31.68,33.28 IC3.25 31.7,37 30.98,37.73 30.98,39.97 | 31.68,33.28 31.74,33.22 34.53,33.22 36.44,31.32 | R22.1 34.05,18.62 34.26,18.42 34.26,15.38 34.05,15.16 32.63,15.16 31.1,16.69 C11.2 29.19,15.31 29.14,15.31 29.01,15.17 29.01,4.61 v28,3.6 27.49,4.11 27.49,11.2 26.8,11.88 21.16,11.88 19.98,13.05 19.98,24.06 21.86,25.93 C16.2 | IC3.51 29.16,24.6 | 29.16,24.6 30.04,25.48 30.69,25.49 36.31,25.5 36.32,25.51 | 29.16,24.6 29.16,24.61 27.34,25.82 IC3.47 | IC3.35 29,31.82 | 29,31.82 30.58,31.83 31.68,33.28 | J8.3 2,37.6 R14.2 1.25,20.22 1.25,12.7 C2.1 | IC5.4 R16.1 v15,20.6 | IC4.2 32.93,12.43 32.02,8.57 32.02,4.6 v32,3.6 | C14.2 30.98,39.97 | 30.98,39.97 C15.2 | C8.2 24.68,18.87 C9.2 v22,17.6
  Top 0.152: U$2.P$6 U$2.P$11 U$2.P$7 U$2.GND | U$2.P$8 U$2.P$10 U$2.P$9 64.01,27.33 R6.2 | U2.15 v32.6,51.69 | C19.2 48.68,34.11 46.66,34.76 C18.2 | C18.2 44.58,37.91 44.55,41.21 47.17,43.39 | 47.17,43.39 ESP-PROG.P$2 | EMIFILTER2.4 EMIFILTER2.2 47.17,43.39 | C12.2 C18.2 | C17.2 20.89,32.95 20.2,33.64 20.2,35 21.05,35.86 24.37,35.86 28.4,31.82 29,31.82 | IC2.6 IC2.7 IC2.2 | IC2.3 IC2.2 | IC2.2 16.29,70.78 16,71.07
  Bottom 0.152: J8.3 11,41.6 9,43.6 9,49.6 11,51.6 11,69.6 J6.1 | DNPAIR1.GND 77,66.02 77,58.58 SHITTY_ADDON.GND 74.33,54.27 77,51.6 77,33.6 76,32.6 | 76,32.6 60,32.6 51,41.6 51,46.56 51.02,46.58 | 51.02,46.58 ESP-PROG.P$2 | 76.37,22.6 U$2.P$11 76,32.6 | 76.37,22.6 U$2.P$10 | v32.6,51.69 51.02,46.58 | 76.37,22.6 76,11.6 70,3.6 v32,3.6 v28,3.6 22.74,8.86 22.74,11.06 22.06,11.75 21.29,11.75 20.4,12.64 20.4,15.2 v15,20.6 v22,17.6
  pour Bottom (isolate 1.016): 0,74.6 0,0.1 0.5,-0.4 82,-0.4 82.5,0.1 82.5,74.6
IO34
  Top 0.152: U2.6 29.5,67.2 29.21,67.2 18.58,56.57 11.96,56.57 6.27,50.87 J5.6
IO35
  Top 0.152: U2.7 29.44,66.12 18.77,55.45 12.76,55.45 8,50.68 8,49.52 J5.8
JTAG_CLK
  Top 0.152: U2.16 34.24,46.92 37.67,43.5 IC3.16
JTAG_TDI
  Top 0.152: IC3.17 35.68,41.92 29.69,47.91 U2.14
JTAG_TDO
  Top 0.152: U2.23 43.13,56.46 42,57.6 32.37,57.6 32.33,57.63 31.03,56.32 31.03,48.4 36.51,42.91 36.51,33.9 35.84,33.22 35.64,33.22 35.18,33.68 IC3.18
JTAG_TMS
  Top 0.152: IC3.19 34.76,34.88 34.76,41.47 28.21,48.02 28.21,57.51 29.2,58.5 U2.13
N$3
  Top 0.152: U$7.P$2 R16.2 IC5.3
N$6
  Top 0.152: IC3.14 38.84,31.82 39.51,32.49 39.47,32.53 R5.2
N$7
  Top 0.152: IC3.6 40.52,27.82 R6.1
N$8
  Top 0.152: IC4.1 32.78,13.38 R9.1 31.05,13.27 30.54,13.27 R10.1
N$9
  Top 0.152: R15.1 U$7.P$1
N$11
  Top 0.152: R11.1 LED2.A
N$12
  Top 0.152: RESETTABLE_FUSE.2 7.29,66.73 J6.2 | J6.2 10.32,68.92 11,69.6 13.57,69.6 C4.1 13.66,66.82 IC2.4 | IC2.5 13.75,61.08 13.52,61.08 12.52,61.08 10,63.6 10,68.4 J6.2
N$13
  Top 0.152: R12.1 LED3.A
N$14
  Top 0.152: SHITTY_ADDON.VCC D1.C
N$18
  Top 0.152: IC3.9 39.45,29.32 39.79,29.65 44.5,29.65 47.05,32.21 47.05,32.69 | 47.05,32.69 C19.1 | EMIFILTER2.3 46.06,38.02 47.01,37.08 47.13,37.08 47.26,36.94 47.26,36.92 C18.1 50.95,34.59 50.95,31.56 50.06,30.59 48.44,30.59 47.05,32.69
N$19
  Top 0.152: IC3.4 38.85,26.82 40.45,25.22 C21.1 44.49,25.22 C20.1 46.62,25.2 EMIFILTER1.3
OSCI
  Top 0.152: IC3.2 38.38,25.82 38.63,25.57 38.63,25.51 40.26,23.89 40.26,21.3 43.98,17.58 43.98,10.64 45.85,8.77 F1.2 49.82,8.77 C6.1
OSCO
  Top 0.152: IC3.3 38.46,26.32 40.82,23.97 40.82,22.09 44.63,18.27 F1.1 46.34,18.39 C7.1
PROG_RX
  Top 0.152: J1.10 58,62.6 52,68.6 U2.34
PROG_TX
  Top 0.152: U2.35 48.02,69.6 53.4,69.6 J1.11
PWREN
  Top 0.152: R22.2 33.68,21.68 IC3.60
PWRSAV
  Top 0.152: IC3.59 33.18,21.66 32.6,21.08 32.6,18.93 33.43,18.1 R24.2
RXD-SPI_PROM_MOSI
  Top 0.152: IC3.39 19.36,29.86 13.38,25.16 J2.1 11.62,26.05 10.45,27.22 10.45,28.19 11.62,29.36 J2.5
RXD_LED
  Top 0.152: IC3.54 30.68,21.56 29.44,20.32 29.44,17.02 27.04,14.62 23,14.62 21.57,13.19 LED2.K
SCL
  Top 0.152: U2.36 54.34,71.2 J1.12 65,67.54 | 65,67.54 70.94,67.54 71,67.6 72.88,67.6 DNPAIR1.SCL | U$1.SCL 65,65.78 65,67.54
  Bottom 0.152: DNPAIR1.SCL 76,64.48 76,60.12 SHITTY_ADDON.SCL
SD_CS
  Top 0.152: U2.29 49.12,62.31 56.01,55.42 56.01,53.98 57.68,52.3 J1.6
SDA
  Top 0.152: U2.33 47.9,67.6 51,67.6 58,60.6 J1.9 63.61,65.53 U$1.SDA 64.72,64.79 64.72,64.66 65.53,63.85 DNPAIR1.SDA 74.09,63.69 71.79,61.39 SHITTY_ADDON.SDA
SENSORVN
  Top 0.152: U2.5 29.66,68.63 29.4,68.63 18.3,57.53 10.93,57.53 J5.4
SENSORVP
  Top 0.152: U2.4 29.36,69.6 28.7,69.6 25,65.9 25,65.32 18.24,58.57 9.43,58.57 J5.2
SPI_PROM_CLK
  Top 0.152: J2.8 6.03,32.56 4.13,30.61 R14.1 2.07,19.09 2.08,16.78 IC5.6
SPI_PROM_CS
  Top 0.152: IC3.41 20.36,28.84 19.93,28.47 18.03,15.24 17,13.6 R13.1 IC5.1
SPI_PROM_MISO
  Top 0.152: IC3.40 19.77,29.31 14.62,22.62 8.89,22.62 7.12,20.57 7.09,15.58 IC5.2
SPI_PROM_MOSI
  Top 0.152: IC5.5 5,18.6 5,27.6 J2.6
SUSPEND
  Top 0.152: IC3.36 25.19,31.34 R23.2
TOUCH_CLK
  Top 0.152: U2.11 29.62,60.97 28.64,60.97 26.05,58.38 26.05,46.53 18.66,39.14 J8.2
TOUCH_CS
  Top 0.152: U2.12 29.5,59.58 28.51,59.58 27.04,58.1 27.04,45.61 18.03,36.6 J8.1
TOUCH_DATA_IN
  Top 0.152: U2.10 29.53,62.15 28.86,62.15 24.96,58.25 24.96,49.34 19.84,44.22 J8.4
TOUCH_DATA_OUT
  Top 0.152: J8.5 12.47,46.76 24.35,58.64 24.35,58.78 29.06,63.49 29.6,63.49 U2.9
TOUCH_IRQ
  Top 0.152: J8.6 11.06,49.24 11.57,49.24 16.52,54.2 18.68,54.2 28.19,63.72 28.19,63.75 29.31,64.87 29.67,64.87 U2.8
TXD-SPI_PROM_CLK
  Top 0.152: IC3.38 16.68,30.32 J2.3 13.02,29.57 13.07,31.83 J2.7
TXD_LED
  Top 0.152: IC3.55 31.18,21.38 29.9,20.09 29.9,16.76 26.39,13.26 LED3.K
USB_DM
  Top 0.152: IC3.7 68.31,28.32 70.87,25.77 73.32,25.77 U$2.D+
USB_DP
  Top 0.152: IC3.8 50.5,28.82 52.63,30.95 78.04,30.95 78.59,30.4 78.59,25.86 77.85,25.12 73.36,25.12 U$2.D-
VBAT
  Top 0.152: J7.2 4.25,68.81 RESETTABLE_FUSE.1
VCC  (via drill 0.8, 1)
  Top 0.152: U2.2 29.56,72.6 28,72.6 26.12,70.72 C1.1 23.62,70.72 20.05,67.15 | 1,47.6 1,57.6 2.9,59.5 17.87,59.5 19.5,61.13 19.5,66.38 20.05,66.93 | 26.31,1.6 29.7,1.6 | 29.7,1.6 40.5,1.6 | 40.5,1.6 55.18,1.6 | 55.18,1.6 80,1.6 80,49.6 | 80,49.6 70,49.6 67.19,52.41 D1.A 67.19,48.79 J1.1 | U$1.VCC 68.3,65.02 74.57,65.02 80,59.59 80,49.6 | J1.1 52.88,44.72 52.88,48.97 49.75,48.97 R1.2 | IC3.20 34.18,36.62 32.54,38.26 C15.1 33.98,39.59 33.98,41.01 32.11,42.52 25.84,42.48 v24,39.6 | IC3.31 28.68,37.65 C14.1 v24,39.6 | J1.1 49.8,39.6 EMIFILTER2.1 | C8.1 28.68,21.46 IC3.50 28.7,24.28 27.5,24.62 25,24.6 23.55,27.2 | R24.1 32.3,17.26 32.3,18.2 31.57,18.92 C11.1 31.68,19.5 IC3.56 31.8,23.45 31.8,24.16 31.93,24.3 36.03,24.3 40.62,19.7 40.62,19.34 v41.62,18.33 | R12.2 26.31,1.6 | IC3.42 24.75,28.33 C16.1 23.55,27.2 | IC5.7 IC5.8 4.4,12.71 C2.2 4.4,9.7 v7,7.1 | EMIFILTER1.1 52.96,24.27 55.13,21.65 55.18,1.6 | R9.2 29.7,1.6 | v24,39.6 23.87,39.47 R23.1 | R5.1 v40.04,36.26 | v20.97,23.65 23.55,27.2 | v7,7.1 2,7.1 0.5,8.6 0.5,39.38 1,39.88 1,47.6 | v7,7.1 9,7.1 10.36,8.46 R15.2 | v7,7.1 8.5,8.6 8.5,10.1 9.95,11.55 R13.2 | v7,7.1 12.5,1.6 26.31,1.6 | C3.1 40.15,10.1 | 40.15,10.1 40.15,1.95 40.5,1.6 | 40.15,10.1 38.01,10.1 R8.1 | C3.1 39.87,13.38 IC4.6 | C3.1 38.32,14.93 R7.2 | R11.2 26.31,1.9 26.31,1.6 | R4.2 20.88,66.1 20.05,66.93 | 20.05,67.15 19.01,68.18 C5.1 18.75,69.1 18,69.1 17.56,68.66 IC2.1 | 20.05,66.93 20.05,67.15 | J5.7 1.19,47.79 1,47.6
  Bottom 0.152: J5.7 8,35.6 11,34.6 16,34.6 | 16,34.6 v24,39.6 v40.04,36.26 40.5,35.8 43.25,35.8 43.82,35.22 43.82,21.72 41.62,19.52 v41.62,18.33 | v20.97,23.65 16,34.6
VCC1.8  (via drill 1)
  Top 0.152: IC3.12 40.87,30.82 C12.1 42.25,32.65 v42.84,34.82 | IC3.49 27.5,23.33 C9.1 v23.96,23.67 | IC3.64 36.36,23.33 37.38,22.32 C10.1 38.26,20.69 v39.64,18.68 | IC3.37 24,30.89 22.9,31.38 | 22.9,31.38 C17.1 | v21.52,34.34 22.9,31.38
  Bottom 0.152: v23.96,23.67 v21.52,34.34 v42.84,34.82 42.01,33.99 v39.64,18.68